# Altium schematic sheet supply2.SchDoc
size A4
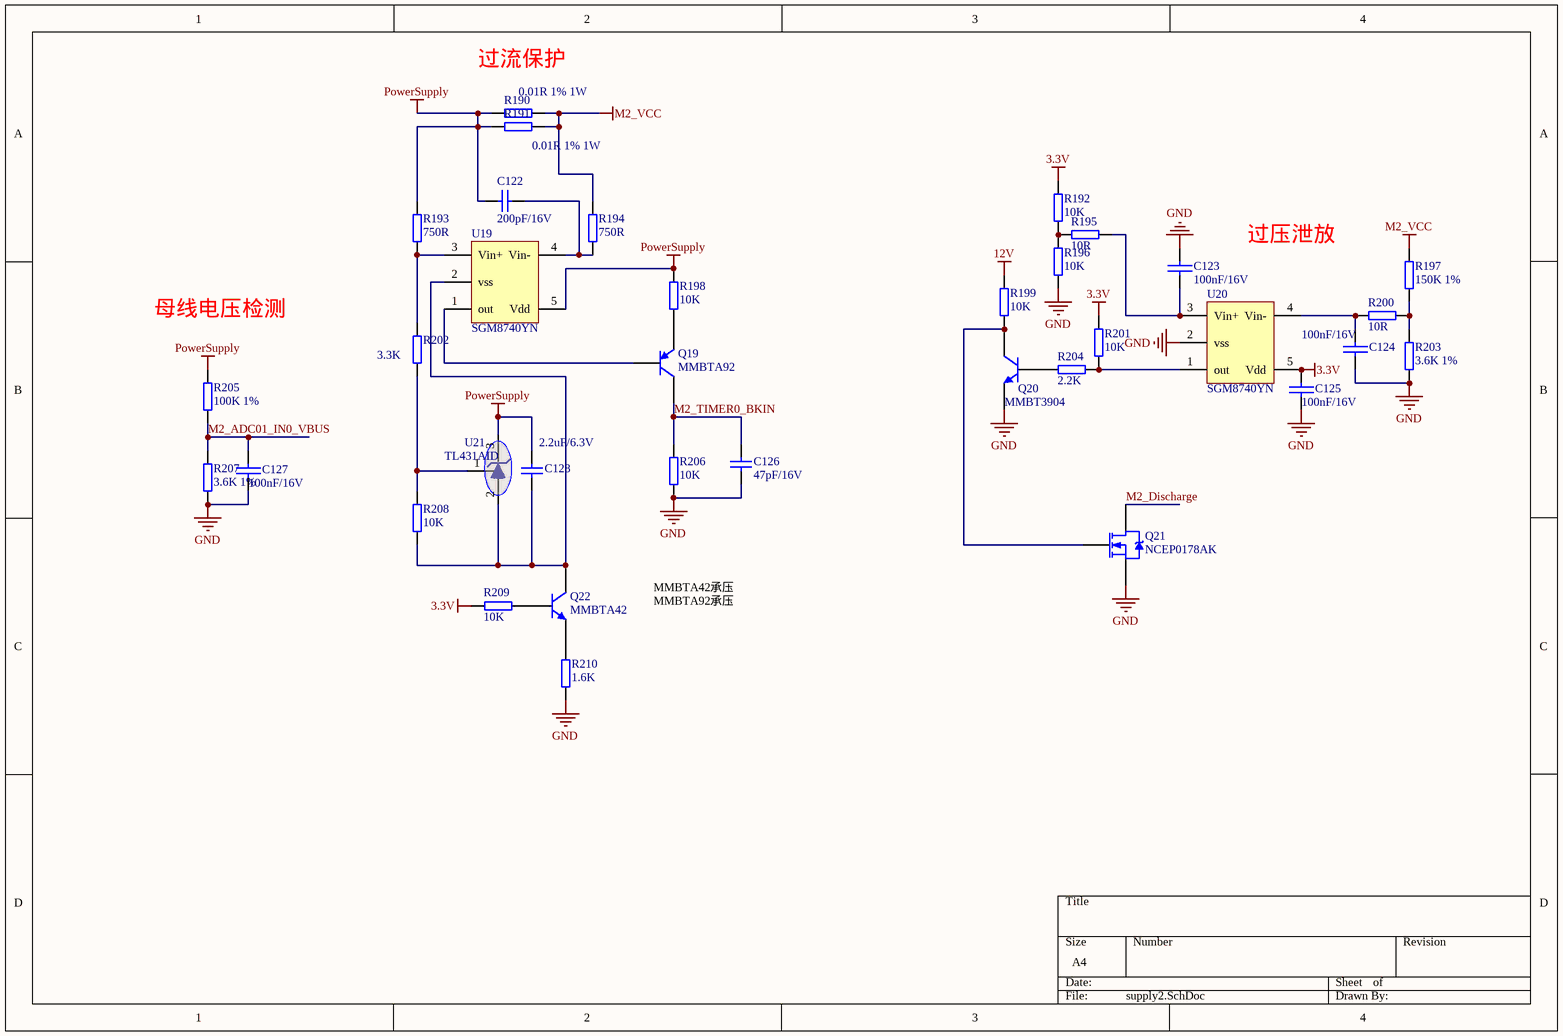
[diagram p0: supply2.SchDoc]

## Parts
C122  200pF/16V  [C0402]
C123  100nF/16V  [C0402]
C124  100nF/16V  [C0402]
C125  100nF/16V  [C0402]
C126  47pF/16V  [C0402]
C127  100nF/16V  [C0402]
C128  2.2uF/6.3V  [C0402]
Q19  MMBTA92  [SOT-23]
Q20  MMBT3904  [SOT-23]
Q21  NCEP0178AK  [D-PAK(TO-252AA)]
Q22  MMBTA42  [SOT-23]
R190  0.01R 1% 1W  [R1210]
R191  0.01R 1% 1W  [R1210]
R192  10K  [R0402]
R193  750R  [R0402]
R194  750R  [R0402]
R195  10R  [R0402]
R196  10K  [R0402]
R197  150K 1%  [R0603]
R198  10K  [R0402]
R199  10K  [R0402]
R200  10R  [R0402]
R201  10K  [R0402]
R202  3.3K  [R0402]
R203  3.6K 1%  [R0603]
R204  2.2K  [R0402]
R205  100K 1%  [R0603]
R206  10K  [R0402]
R207  3.6K 1%  [R0603]
R208  10K  [R0402]
R209  10K  [R0402]
R210  1.6K  [R0402]
U19  SGM8740YN  [SOT-23(5)]
U20  SGM8740YN  [SOT-23(5)]
U21  TL431AID  [SOT-23]

## Nets
3.3V: C125.1 R192.2 R201.2 R209.1 U20.5(Vdd)
12V: R199.2
GND: C123.2 C124.2 C125.2 C126.2 C127.2 Q20.2(E) Q21.2(S) R196.1 R203.1 R206.1 R207.1 R210.1 U20.2(vss)
M2_VCC: R190.1 R191.1 R194.2 R197.2
PowerSupply: C122.2 C128.1 R190.2 R191.2 R193.2 R198.2 R205.2 U19.5(Vdd) U21.3(K)
M2_ADC01_IN0_VBUS: C127.1 R205.1 R207.2
M2_Discharge: Q21.3(D)
M2_TIMER0_BKIN: C126.1 Q19.3(C) R206.2
NetC122_1: C122.1 R194.1 U19.4(Vin-)
NetC123_1: C123.1 R195.1 U20.3(Vin+)
NetC124_1: C124.1 R200.2 U20.4(Vin-)
NetC128_2: C128.2 Q22.3(C) R208.2 U19.2(vss) U21.2(A)
NetQ19_1: Q19.1(B) U19.1(out)
NetQ19_2: Q19.2(E) R198.1
NetQ20_1: Q20.1(B) R204.1
NetQ20_3: Q20.3(C) Q21.1(G) R199.1
NetQ22_1: Q22.1(B) R209.2
NetQ22_2: Q22.2(E) R210.2
NetR192_1: R192.1 R195.2 R196.2
NetR193_1: R193.1 R202.1 U19.3(Vin+)
NetR197_1: R197.1 R200.1 R203.2
NetR201_1: R201.1 R204.2 U20.1(out)
NetR202_2: R202.2 R208.1 U21.1(REF)

## Notes on the sheet
- 过流保护
- 过压泄放
- 母线电压检测
- MMBTA42承压MMBTA92承压

## Library data of the parts
C122 C126 C128 = cap
C123-C125 C127 = CAP: Capacitor
Q19 = PNP
Q20 Q22 = NPN
Q21 = N-channel Enhancement MOS
R190-R210 = Resistance
U19 U20 = LMV7239: 圣邦微电子 丝印 SL5XX
U21 = TL431: 注意引脚关系：1-C 2-R 3-A; pin to pad: 1>2 2>3 3>1